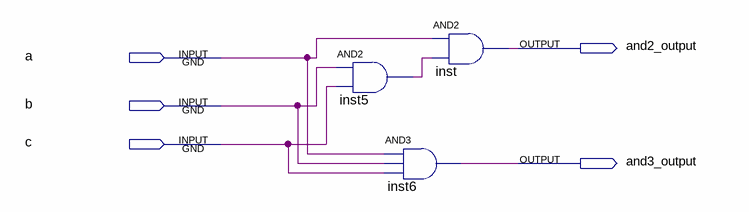
[diagram p0: schematic sheet]
// Quartus schematic 1-1-1.bdf as structural Verilog: 3 symbols, 5 pins
module \1-1-1  (
  input  a,
  input  b,
  input  c,
  output and2_output,
  output and3_output
);

  wire inst5_out;

  and inst5 (inst5_out, b, c);
  and inst6 (and3_output, a, b, c);
  and inst (and2_output, a, inst5_out);
endmodule
